# Altium project CAP_Group.PrjPcb
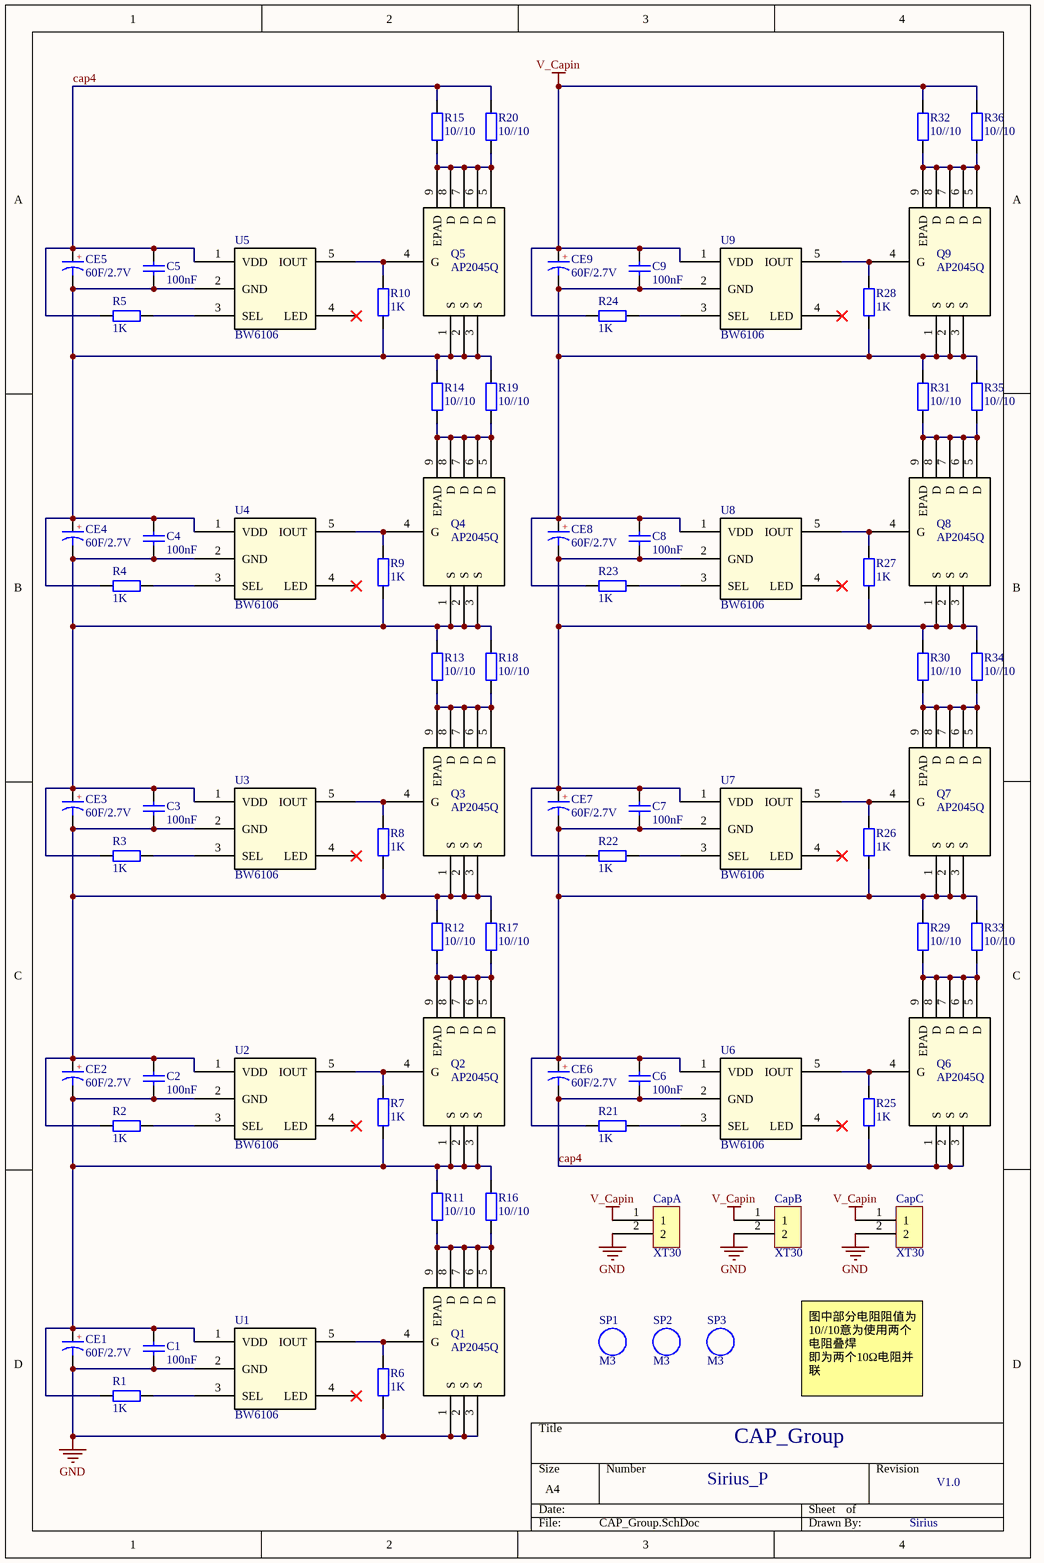
[diagram p0: CAP_Group.SchDoc]
1 sheet, 78 parts. Net scope: global (net labels, ports and power ports of the same name join across sheets).
Board file: CAP_Group.PcbDoc

## Sheet CAP_Group.SchDoc
size A4 portrait; SheetNumber: 1; SheetTotal: 1

### Parts
C1  100nF  [C0603_L]
C2  100nF  [C0603_L]
C3  100nF  [C0603_L]
C4  100nF  [C0603_L]
C5  100nF  [C0603_L]
C6  100nF  [C0603_L]
C7  100nF  [C0603_L]
C8  100nF  [C0603_L]
C9  100nF  [C0603_L]
CapA  XT30  [XT30-F]
CapB  XT30  [XT30-F]
CapC  XT30  [XT30-F]
CE1  60F/2.7V  [CE-7.5*18*35.5 - BK]
CE2  60F/2.7V  [CE-7.5*18*35.5 - BK]
CE3  60F/2.7V  [CE-7.5*18*35.5 - BK]
CE4  60F/2.7V  [CE-7.5*18*35.5 - BK]
CE5  60F/2.7V  [CE-7.5*18*35.5 - BK]
CE6  60F/2.7V  [CE-7.5*18*35.5 - BK]
CE7  60F/2.7V  [CE-7.5*18*35.5 - BK]
CE8  60F/2.7V  [CE-7.5*18*35.5 - BK]
CE9  60F/2.7V  [CE-7.5*18*35.5 - BK]
Q1  AP2045Q  [TDFN33-8]
Q2  AP2045Q  [TDFN33-8]
Q3  AP2045Q  [TDFN33-8]
Q4  AP2045Q  [TDFN33-8]
Q5  AP2045Q  [TDFN33-8]
Q6  AP2045Q  [TDFN33-8]
Q7  AP2045Q  [TDFN33-8]
Q8  AP2045Q  [TDFN33-8]
Q9  AP2045Q  [TDFN33-8]
R1  1K  [R0603_L]
R2  1K  [R0603_L]
R3  1K  [R0603_L]
R4  1K  [R0603_L]
R5  1K  [R0603_L]
R6  1K  [R0603_L]
R7  1K  [R0603_L]
R8  1K  [R0603_L]
R9  1K  [R0603_L]
R10  1K  [R0603_L]
R11  10//10  [R2512_L]
R12  10//10  [R2512_L]
R13  10//10  [R2512_L]
R14  10//10  [R2512_L]
R15  10//10  [R2512_L]
R16  10//10  [R2512_L]
R17  10//10  [R2512_L]
R18  10//10  [R2512_L]
R19  10//10  [R2512_L]
R20  10//10  [R2512_L]
R21  1K  [R0603_L]
R22  1K  [R0603_L]
R23  1K  [R0603_L]
R24  1K  [R0603_L]
R25  1K  [R0603_L]
R26  1K  [R0603_L]
R27  1K  [R0603_L]
R28  1K  [R0603_L]
R29  10//10  [R2512_L]
R30  10//10  [R2512_L]
R31  10//10  [R2512_L]
R32  10//10  [R2512_L]
R33  10//10  [R2512_L]
R34  10//10  [R2512_L]
R35  10//10  [R2512_L]
R36  10//10  [R2512_L]
SP1  M3  [M3 125X200]
SP2  M3  [M3 125X200]
SP3  M3  [M3 125X200]
U1  BW6106  [SOT23-5L]
U2  BW6106  [SOT23-5L]
U3  BW6106  [SOT23-5L]
U4  BW6106  [SOT23-5L]
U5  BW6106  [SOT23-5L]
U6  BW6106  [SOT23-5L]
U7  BW6106  [SOT23-5L]
U8  BW6106  [SOT23-5L]
U9  BW6106  [SOT23-5L]

### Nets
GND: C1.2 CapA.2 CapB.2 CapC.2 CE1.2 Q1.1(S) Q1.2(S) Q1.3(S) R6.1 U1.2(GND)
V_Capin: C9.1 CapA.1 CapB.1 CapC.1 CE9.1 R24.1 R32.2 R36.2 U9.1(VDD)
cap4: C5.1 C6.2 CE5.1 CE6.2 Q6.1(S) Q6.2(S) Q6.3(S) R5.1 R15.2 R20.2 R25.1 U5.1(VDD) U6.2(GND)
NetC1_1: C1.1 C2.2 CE1.1 CE2.2 Q2.1(S) Q2.2(S) Q2.3(S) R1.1 R7.1 R11.2 R16.2 U1.1(VDD) U2.2(GND)
NetC2_1: C2.1 C3.2 CE2.1 CE3.2 Q3.1(S) Q3.2(S) Q3.3(S) R2.1 R8.1 R12.2 R17.2 U2.1(VDD) U3.2(GND)
NetC3_1: C3.1 C4.2 CE3.1 CE4.2 Q4.1(S) Q4.2(S) Q4.3(S) R3.1 R9.1 R13.2 R18.2 U3.1(VDD) U4.2(GND)
NetC4_1: C4.1 C5.2 CE4.1 CE5.2 Q5.1(S) Q5.2(S) Q5.3(S) R4.1 R10.1 R14.2 R19.2 U4.1(VDD) U5.2(GND)
NetC6_1: C6.1 C7.2 CE6.1 CE7.2 Q7.1(S) Q7.2(S) Q7.3(S) R21.1 R26.1 R29.2 R33.2 U6.1(VDD) U7.2(GND)
NetC7_1: C7.1 C8.2 CE7.1 CE8.2 Q8.1(S) Q8.2(S) Q8.3(S) R22.1 R27.1 R30.2 R34.2 U7.1(VDD) U8.2(GND)
NetC8_1: C8.1 C9.2 CE8.1 CE9.2 Q9.1(S) Q9.2(S) Q9.3(S) R23.1 R28.1 R31.2 R35.2 U8.1(VDD) U9.2(GND)
NetQ1_4: Q1.4(G) R6.2 U1.5(IOUT)
NetQ1_5: Q1.5(D) Q1.6(D) Q1.7(D) Q1.8(D) Q1.9(EPAD) R11.1 R16.1
NetQ2_4: Q2.4(G) R7.2 U2.5(IOUT)
NetQ2_5: Q2.5(D) Q2.6(D) Q2.7(D) Q2.8(D) Q2.9(EPAD) R12.1 R17.1
NetQ3_4: Q3.4(G) R8.2 U3.5(IOUT)
NetQ3_5: Q3.5(D) Q3.6(D) Q3.7(D) Q3.8(D) Q3.9(EPAD) R13.1 R18.1
NetQ4_4: Q4.4(G) R9.2 U4.5(IOUT)
NetQ4_5: Q4.5(D) Q4.6(D) Q4.7(D) Q4.8(D) Q4.9(EPAD) R14.1 R19.1
NetQ5_4: Q5.4(G) R10.2 U5.5(IOUT)
NetQ5_5: Q5.5(D) Q5.6(D) Q5.7(D) Q5.8(D) Q5.9(EPAD) R15.1 R20.1
NetQ6_4: Q6.4(G) R25.2 U6.5(IOUT)
NetQ6_5: Q6.5(D) Q6.6(D) Q6.7(D) Q6.8(D) Q6.9(EPAD) R29.1 R33.1
NetQ7_4: Q7.4(G) R26.2 U7.5(IOUT)
NetQ7_5: Q7.5(D) Q7.6(D) Q7.7(D) Q7.8(D) Q7.9(EPAD) R30.1 R34.1
NetQ8_4: Q8.4(G) R27.2 U8.5(IOUT)
NetQ8_5: Q8.5(D) Q8.6(D) Q8.7(D) Q8.8(D) Q8.9(EPAD) R31.1 R35.1
NetQ9_4: Q9.4(G) R28.2 U9.5(IOUT)
NetQ9_5: Q9.5(D) Q9.6(D) Q9.7(D) Q9.8(D) Q9.9(EPAD) R32.1 R36.1
NetR1_2: R1.2 U1.3(SEL)
NetR2_2: R2.2 U2.3(SEL)
NetR3_2: R3.2 U3.3(SEL)
NetR4_2: R4.2 U4.3(SEL)
NetR5_2: R5.2 U5.3(SEL)
NetR21_2: R21.2 U6.3(SEL)
NetR22_2: R22.2 U7.3(SEL)
NetR23_2: R23.2 U8.3(SEL)
NetR24_2: R24.2 U9.3(SEL)

Not connected (* = marked no-connect by the designer): U1 4(LED)*; U2 4(LED)*; U3 4(LED)*; U4 4(LED)*; U5 4(LED)*; U6 4(LED)*; U7 4(LED)*; U8 4(LED)*; U9 4(LED)*

### Notes on the sheet
- CAP_Group
- 图中部分电阻阻值为10//10意为使用两个电阻叠焊
  即为两个10Ω电阻并联
- Sirius_P
- V1.0
- Sirius
- (in symbol CE) +

### Library data of the parts
C1-C9 = C: 贴片电容; BOM名称: 无极性贴片电容; 联系卖家，免费查找封装: 唯一出售店铺网址https://shop463601444.taobao.com
CE1-CE9 = CE: 直插电解电容; 联系卖家，免费查找封装: 唯一出售店铺网址https://shop463601444.taobao.com; BOM名称: 直插电解电容
Q1-Q9 = AP2045Q: Trans MOSFET P-CH 20V 65A 8-Pin PDFN EP T/R; Manufacturer_Name: Taiwan Semiconductor; Manufacturer_Part_Number: TSM085P03CV RGG; Geometry.Height: 0.75mm; Mouser Part Number: 821-TSM085P03CVRGG; Mouser Price/Stock: https://www.mouser.co.uk/ProductDetail/Taiwan-Semiconductor/TSM085P03CV-RGG?qs=4pzlT8jjbhd4XXSAn%252BJ6qw%3D%3D; Arrow Part Number: TSM085P03CV RGG; Arrow Price/Stock: https://www.arrow.com/en/products/tsm085p03cvrgg/taiwan-semiconductor; Mouser Testing Part Number: *; Mouser Testing Price/Stock: *; Datasheet Link: https://componentsearchengine.com/Datasheets/1/TSM085P03CV RGG.pdf
R1-R36 = R: 贴片电阻; 联系卖家，免费查找封装: 唯一出售店铺网址https://shop463601444.taobao.com; BOM名称: 贴片电阻
SP1-SP3 = M3: 铜柱孔; 联系卖家，免费查找封装: 唯一出售店铺网址https://shop463601444.taobao.com; 封装库来自淘宝卖家ID：黄晶宝石: 其他店铺购入均为盗版假冒封装库，请立即申请退款; BOM名称: 铜柱孔
U1-U9 = BW6106: 电容充电保护芯片